# EAGLE design UltrasonicSensor (EAGLE 9.2.1)
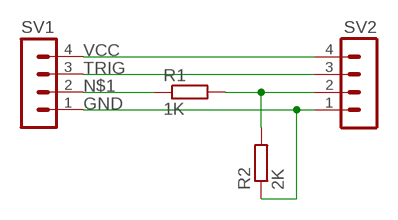
[diagram p0: schematic, sheet 1]

## Parts
R1  1K  R-EU_0204/7  [0204/7]
R2  2K  R-EU_0204/7  [0204/7]
SV1  MA04-1  [MA04-1]
SV2  MA04-1  [MA04-1]

## Nets
EHO: R1.2 R2.2 SV2.2
GND: R2.1 SV1.1 SV2.1
N$1: R1.1 SV1.2
TRIG: SV1.3 SV2.3
VCC: SV1.4 SV2.4

## Library data of the parts
R1 R2 = rcl:R-EU_: RESISTOR, European symbol; SPICEPREFIX: R
SV1 SV2 = con-lstb:MA04-1: PIN HEADER; OC_FARNELL: unknown; OC_NEWARK: unknown

## Board
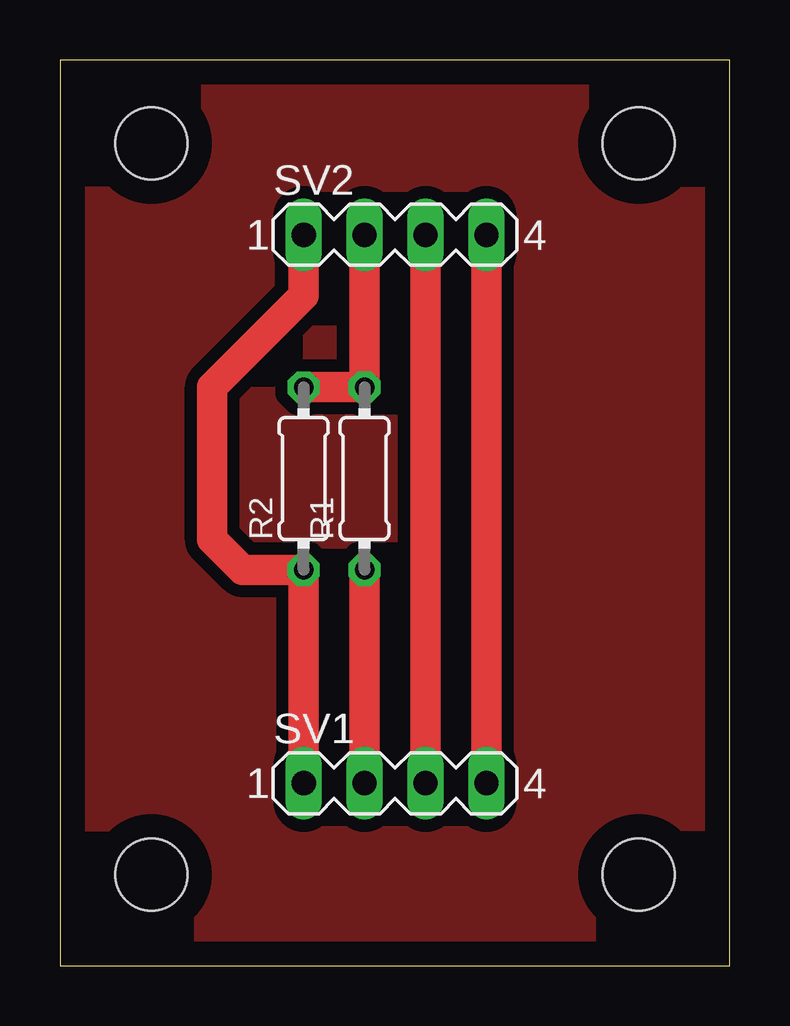
[diagram p1: board, top side]

Size 27.92 x 37.77 mm. Coordinates in mm from the lower left corner, seen from the top.
Outline: 0,0 27.92,0 27.92,37.77 0,37.77 0,0
Copper layers (1*16): Top 0.035mm / dielectric 1.5mm / Bottom 0.035mm
Design rules "default *": minimum track width 20mil, minimum drill 0.35mm, track to track 20mil, track to pad 20mil, pad to pad 20mil, via to via 20mil, smd to smd 6mil, copper to edge 40mil, drill to drill 6mil, minimum pad ring 10mil, minimum via ring 8mil, stop-mask expansion 4mil, vias tented up to drill 0mil, thermal gap 10mil
Holes 3 mm at 3.81,34.29 24.13,34.29 24.13,3.81 3.81,3.81

### Footprints (pad centres in the part's own frame; a part is rotated, then mirrored left to right if it is on the bottom)
0204/7 = drill 0.813 octagon: 1 -3.81,0; 2 3.81,0
MA04-1 = drill 1.016 long: 1 -3.81,0; 2 -1.27,0; 3 1.27,0; 4 3.81,0

### Placement (x,y rotation side)
R1  12.7,20.32 90 top
R2  10.16,20.32 90 top
SV1  13.97,7.62 0 top
SV2  13.97,30.48 0 top

### Tracks (layer width: path | path; a pad name or v marks a point on that pad's centre or on a via)
EHO
  Top 1.27: R2.2 R1.2 SV2.2
GND
  Top 1.27: SV1.1 R2.1 7.62,16.51 6.35,17.78 6.35,24.13 10.16,27.94 SV2.1
N$1
  Top 1.27: SV1.2 R1.1
NONE
  pour Top: 0,38.1 27.94,38.1 27.94,0 0,0
TRIG
  Top 1.27: SV1.3 SV2.3
VCC
  Top 1.27: SV1.4 SV2.4